# Altium schematic sheet 1_interface.schdoc: OBDH Interface
size A3; Engineer: Eng_2_ALT; SheetNumber: 1; SheetTotal: 6; Designed by: André M. P. Mattos; Version: v0.5
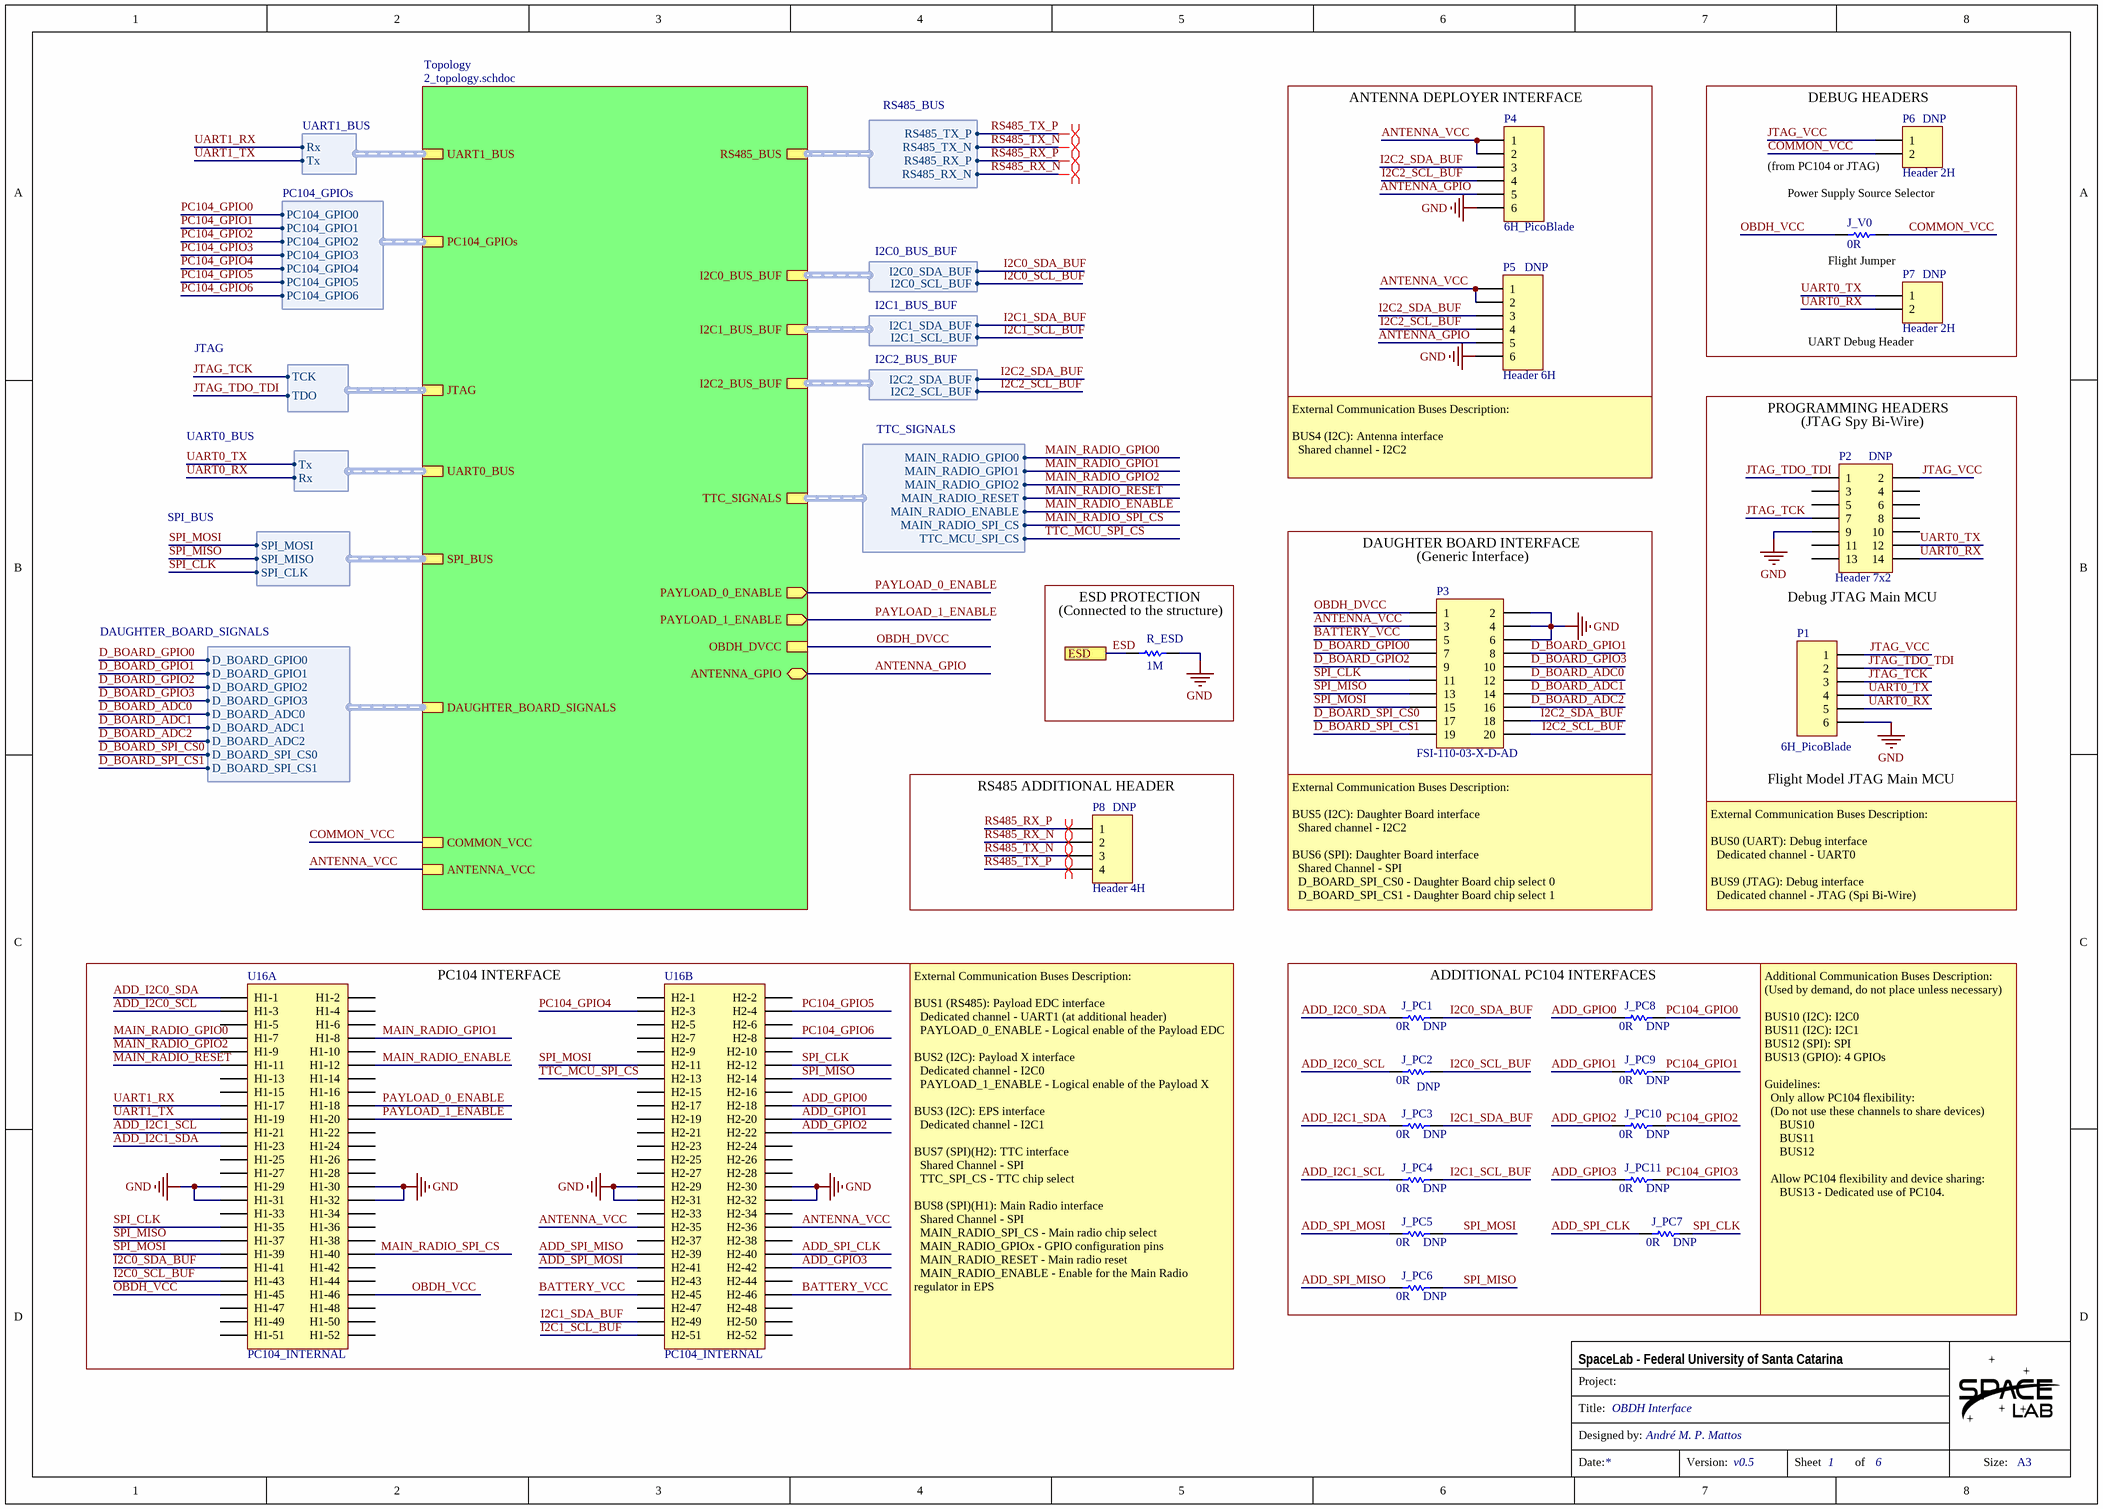
[diagram p0: 1_interface.schdoc]

## Parts
J_PC1  0R  [0805]
J_PC2  0R  [0805]
J_PC3  0R  [0805]
J_PC4  0R  [0805]
J_PC5  0R  [0805]
J_PC6  0R  [0805]
J_PC7  0R  [0805]
J_PC8  0R  [0805]
J_PC9  0R  [0805]
J_PC10  0R  [0805]
J_PC11  0R  [0805]
J_V0  0R  [0805]
P1  6H_PicoBlade  [HDR6 PicoBlade]
P2  Header 7x2  [HDR2X7]
P3  FSI-110-03-X-D-AD  [FSI-110-03-X-D-AD]
P4  6H_PicoBlade  [HDR6 PicoBlade]
P5  Header 6H  [HDR1X6H]
P6  Header 2H  [HDR 1X2]
P7  Header 2H  [HDR 1X2]
P8  Header 4H  [HDR1X4]
R_ESD  1M  [0805]
U16  PC104_INTERNAL  [PC104]  (parts A,B of 2)

## Blocks framed on the sheet
ANTENNA DEPLOYER INTERFACE: P4 P5
DEBUG HEADERS: J_V0 P6 P7
RS485 ADDITIONAL HEADER: P8
PC104 INTERFACE: U16
ADDITIONAL PC104 INTERFACES: J_PC1-J_PC11

## Sub-sheets
Topology = 2_topology.schdoc: PAYLOAD_0_ENABLE (out), PAYLOAD_1_ENABLE (out), ANTENNA_GPIO (bidir), UART0_BUS (harness UART0_BUS), JTAG (harness JTAG), RS485_BUS (harness RS485_BUS), I2C2_BUS_BUF (harness I2C2_BUS_BUF), I2C1_BUS_BUF (harness I2C1_BUS_BUF), I2C0_BUS_BUF (harness I2C0_BUS_BUF), SPI_BUS (harness SPI_BUS), TTC_SIGNALS (harness TTC_SIGNALS), ANTENNA_VCC, COMMON_VCC, DAUGHTER_BOARD_SIGNALS (harness DAUGHTER_BOARD_SIGNALS), OBDH_DVCC, PC104_GPIOs (harness PC104_GPIOs), UART1_BUS (harness UART1_BUS)

## Ports
ESD

## Harnesses
JTAG: TDO, TCK
UART0_BUS: Rx, Tx
I2C0_BUS_BUF: I2C0_SDA_BUF, I2C0_SCL_BUF
I2C2_BUS_BUF: I2C2_SDA_BUF, I2C2_SCL_BUF
I2C1_BUS_BUF: I2C1_SDA_BUF, I2C1_SCL_BUF
RS485_BUS: RS485_TX_P, RS485_TX_N, RS485_RX_P, RS485_RX_N
SPI_BUS: SPI_CLK, SPI_MISO, SPI_MOSI
TTC_SIGNALS: MAIN_RADIO_GPIO0, MAIN_RADIO_GPIO1, MAIN_RADIO_GPIO2, MAIN_RADIO_RESET, MAIN_RADIO_ENABLE, MAIN_RADIO_SPI_CS, TTC_MCU_SPI_CS
DAUGHTER_BOARD_SIGNALS: D_BOARD_GPIO3, D_BOARD_GPIO2, D_BOARD_ADC0, D_BOARD_ADC1, D_BOARD_GPIO1, D_BOARD_GPIO0, D_BOARD_ADC2, D_BOARD_SPI_CS0, D_BOARD_SPI_CS1
UART1_BUS: Rx, Tx
PC104_GPIOs: PC104_GPIO0, PC104_GPIO1, PC104_GPIO2, PC104_GPIO3, PC104_GPIO4, PC104_GPIO5, PC104_GPIO6

## Nets
GND: P1.6 P2.9 P3.2 P3.4 P3.6 P4.6 P5.6 R_ESD.1 U16.H1-29 U16.H1-30 U16.H1-31 U16.H1-32 U16.H2-29 U16.H2-30 U16.H2-31 U16.H2-32
ADD_GPIO0: J_PC8.1 U16.H2-18
ADD_GPIO1: J_PC9.1 U16.H2-20
ADD_GPIO2: J_PC10.1 U16.H2-22
ADD_GPIO3: J_PC11.1 U16.H2-42
ADD_I2C0_SCL: J_PC2.1 U16.H1-3
ADD_I2C0_SDA: J_PC1.1 U16.H1-1
ADD_I2C1_SCL: J_PC4.1 U16.H1-21
ADD_I2C1_SDA: J_PC3.1 U16.H1-23
ADD_SPI_CLK: J_PC7.1 U16.H2-40
ADD_SPI_MISO: J_PC6.1 U16.H2-39
ADD_SPI_MOSI: J_PC5.1 U16.H2-41
ANTENNA_GPIO: P4.5 P5.5 ; sheet Topology/ANTENNA_GPIO
ANTENNA_VCC: P3.3 P4.1 P4.2 P5.1 P5.2 U16.H2-35 U16.H2-36 ; sheet Topology/ANTENNA_VCC
BATTERY_VCC: P3.5 U16.H2-45 U16.H2-46
COMMON_VCC: J_V0.2 P6.2 ; sheet Topology/COMMON_VCC
D_BOARD_ADC0: P3.12 ; sheet Topology/DAUGHTER_BOARD_SIGNALS.D_BOARD_ADC0
D_BOARD_ADC1: P3.14 ; sheet Topology/DAUGHTER_BOARD_SIGNALS.D_BOARD_ADC1
D_BOARD_ADC2: P3.16 ; sheet Topology/DAUGHTER_BOARD_SIGNALS.D_BOARD_ADC2
D_BOARD_GPIO0: P3.7 ; sheet Topology/DAUGHTER_BOARD_SIGNALS.D_BOARD_GPIO0
D_BOARD_GPIO1: P3.8 ; sheet Topology/DAUGHTER_BOARD_SIGNALS.D_BOARD_GPIO1
D_BOARD_GPIO2: P3.9 ; sheet Topology/DAUGHTER_BOARD_SIGNALS.D_BOARD_GPIO2
D_BOARD_GPIO3: P3.10 ; sheet Topology/DAUGHTER_BOARD_SIGNALS.D_BOARD_GPIO3
D_BOARD_SPI_CS0: P3.17 ; sheet Topology/DAUGHTER_BOARD_SIGNALS.D_BOARD_SPI_CS0
D_BOARD_SPI_CS1: P3.19 ; sheet Topology/DAUGHTER_BOARD_SIGNALS.D_BOARD_SPI_CS1
ESD: R_ESD.2 ; port ESD
I2C0_SCL_BUF: J_PC2.2 U16.H1-43 ; sheet Topology/I2C0_BUS_BUF.I2C0_SCL_BUF
I2C0_SDA_BUF: J_PC1.2 U16.H1-41 ; sheet Topology/I2C0_BUS_BUF.I2C0_SDA_BUF
I2C1_SCL_BUF: J_PC4.2 U16.H2-51 ; sheet Topology/I2C1_BUS_BUF.I2C1_SCL_BUF
I2C1_SDA_BUF: J_PC3.2 U16.H2-49 ; sheet Topology/I2C1_BUS_BUF.I2C1_SDA_BUF
I2C2_SCL_BUF: P3.20 P4.4 P5.4 ; sheet Topology/I2C2_BUS_BUF.I2C2_SCL_BUF
I2C2_SDA_BUF: P3.18 P4.3 P5.3 ; sheet Topology/I2C2_BUS_BUF.I2C2_SDA_BUF
JTAG_TCK: P1.3 P2.7 ; sheet Topology/JTAG.TCK
JTAG_TDO_TDI: P1.2 P2.1 ; sheet Topology/JTAG.TDO
JTAG_VCC: P1.1 P2.2 P6.1
MAIN_RADIO_ENABLE: U16.H1-12 ; sheet Topology/TTC_SIGNALS.MAIN_RADIO_ENABLE
MAIN_RADIO_GPIO0: U16.H1-7 ; sheet Topology/TTC_SIGNALS.MAIN_RADIO_GPIO0
MAIN_RADIO_GPIO1: U16.H1-8 ; sheet Topology/TTC_SIGNALS.MAIN_RADIO_GPIO1
MAIN_RADIO_GPIO2: U16.H1-9 ; sheet Topology/TTC_SIGNALS.MAIN_RADIO_GPIO2
MAIN_RADIO_RESET: U16.H1-11 ; sheet Topology/TTC_SIGNALS.MAIN_RADIO_RESET
MAIN_RADIO_SPI_CS: U16.H1-40 ; sheet Topology/TTC_SIGNALS.MAIN_RADIO_SPI_CS
OBDH_DVCC: P3.1 ; sheet Topology/OBDH_DVCC
OBDH_VCC: J_V0.1 U16.H1-45 U16.H1-46
PAYLOAD_0_ENABLE: U16.H1-18 ; sheet Topology/PAYLOAD_0_ENABLE
PAYLOAD_1_ENABLE: U16.H1-20 ; sheet Topology/PAYLOAD_1_ENABLE
PC104_GPIO0: J_PC8.2 ; sheet Topology/PC104_GPIOs.PC104_GPIO0
PC104_GPIO1: J_PC9.2 ; sheet Topology/PC104_GPIOs.PC104_GPIO1
PC104_GPIO2: J_PC10.2 ; sheet Topology/PC104_GPIOs.PC104_GPIO2
PC104_GPIO3: J_PC11.2 ; sheet Topology/PC104_GPIOs.PC104_GPIO3
PC104_GPIO4: U16.H2-3 ; sheet Topology/PC104_GPIOs.PC104_GPIO4
PC104_GPIO5: U16.H2-4 ; sheet Topology/PC104_GPIOs.PC104_GPIO5
PC104_GPIO6: U16.H2-8 ; sheet Topology/PC104_GPIOs.PC104_GPIO6
RS485_RX_N: P8.2 ; sheet Topology/RS485_BUS.RS485_RX_N
RS485_RX_P: P8.1 ; sheet Topology/RS485_BUS.RS485_RX_P
RS485_TX_N: P8.3 ; sheet Topology/RS485_BUS.RS485_TX_N
RS485_TX_P: P8.4 ; sheet Topology/RS485_BUS.RS485_TX_P
SPI_CLK: J_PC7.2 P3.11 U16.H1-35 U16.H2-12 ; sheet Topology/SPI_BUS.SPI_CLK
SPI_MISO: J_PC6.2 P3.13 U16.H1-37 U16.H2-14 ; sheet Topology/SPI_BUS.SPI_MISO
SPI_MOSI: J_PC5.2 P3.15 U16.H1-39 U16.H2-11 ; sheet Topology/SPI_BUS.SPI_MOSI
TTC_MCU_SPI_CS: U16.H2-13 ; sheet Topology/TTC_SIGNALS.TTC_MCU_SPI_CS
UART0_RX: P1.5 P2.14 P7.2 ; sheet Topology/UART0_BUS.Rx
UART0_TX: P1.4 P2.12 P7.1 ; sheet Topology/UART0_BUS.Tx
UART1_RX: U16.H1-17 ; sheet Topology/UART1_BUS.Rx
UART1_TX: U16.H1-19 ; sheet Topology/UART1_BUS.Tx

Not connected (* = marked no-connect by the designer): P2 3 4 5 6 8 10 11 13; U16 H1-2 H1-4 H1-5 H1-6 H1-10 H1-13 H1-14 H1-15 H1-16 H1-22 H1-24 H1-25 H1-26 H1-27 H1-28 H1-33 H1-34 H1-36 H1-38 H1-42 H1-44 H1-47 H1-48 H1-49 H1-50 H1-51 H1-52 H2-1 H2-2 H2-5 H2-6 H2-7 H2-9 H2-10 H2-15 H2-16 H2-17 H2-19 H2-21 H2-23 H2-24 H2-25 H2-26 H2-27 H2-28 H2-33 H2-34 H2-37 H2-38 H2-43 H2-44 H2-47 H2-48 H2-50 H2-52

## Layout directives
differential pair: RS485_RX_N, RS485_RX_P, RS485_TX_N, RS485_TX_P

## Notes on the sheet
- (near P6) (from PC104 or JTAG)
- (near P6) DNP
- Power Supply Source Selector
- (near P5) DNP
- Flight Jumper
- (near P7) DNP
- (near P7) UART Debug Header
- PROGRAMMING HEADERS
- (near P2) (JTAG Spy Bi-Wire)
- (near P5) External Communication Buses Description:
  BUS4 (I2C): Antenna interface
  Shared channel - I2C2
- (near P2) DNP
- DAUGHTER BOARD INTERFACE
- (near P3) (Generic Interface)
- (near R_ESD) (Connected to the structure)
- (near R_ESD) ESD PROTECTION
- Debug JTAG Main MCU
- (near P1) Flight Model JTAG Main MCU
- (near P8) DNP
- (near P3) External Communication Buses Description:
  BUS5 (I2C): Daughter Board interface
  Shared channel - I2C2
  BUS6 (SPI): Daughter Board interface
  Shared Channel - SPI
  D_BOARD_SPI_CS0 - Daughter Board chip select 0
  D_BOARD_SPI_CS1 - Daughter Board chip select 1
- External Communication Buses Description:
  BUS0 (UART): Debug interface
  Dedicated channel - UART0
  BUS9 (JTAG): Debug interface
  Dedicated channel - JTAG (Spi Bi-Wire)
- (near J_PC1) DNP
- (near J_PC8) DNP
- (near J_PC2) DNP
- (near J_PC9) DNP
- (near J_PC3) DNP
- (near J_PC4) DNP
- (near J_PC10) DNP
- (near J_PC11) DNP
- (near J_PC5) DNP
- (near J_PC7) DNP
- (near J_PC6) DNP
- Additional Communication Buses Description:
  (Used by demand, do not place unless necessary)
  BUS10 (I2C): I2C0
  BUS11 (I2C): I2C1
  BUS12 (SPI): SPI
  BUS13 (GPIO): 4 GPIOs
  Guidelines:
  Only allow PC104 flexibility:
  (Do not use these channels to share devices)
  BUS10
  BUS11
  BUS12
  Allow PC104 flexibility and device sharing:
  BUS13 - Dedicated use of PC104.
- External Communication Buses Description:
  BUS1 (RS485): Payload EDC interface
  Dedicated channel - UART1 (at additional header)
  PAYLOAD_0_ENABLE - Logical enable of the Payload EDC
  BUS2 (I2C): Payload X interface
  Dedicated channel - I2C0
  PAYLOAD_1_ENABLE - Logical enable of the Payload X
  BUS3 (I2C): EPS interface
  Dedicated channel - I2C1
  BUS7 (SPI)(H2): TTC interface
  Shared Channel - SPI
  TTC_SPI_CS - TTC chip select
  BUS8 (SPI)(H1): Main Radio interface
  Shared Channel - SPI
  MAIN_RADIO_SPI_CS - Main radio chip select
  MAIN_RADIO_GPIOx - GPIO configuration pins
  MAIN_RADIO_RESET - Main radio reset
  MAIN_RADIO_ENABLE - Enable for the Main Radio regulator in EPS
- Project:
- SpaceLab - Federal University of Santa Catarina
- Title:
- Designed by:
- Date:
- Version:
- Sheet
- of
- Size:
- A3

## Library data of the parts
J_PC1-J_PC11 J_V0 = R0R_JUMPER_1/16W_0805: RES 0R OHM 1/16W JUMPER 0805; Partnumber: CRCW08050000Z0EA; NCM: 8533.21.20
P1 P4 = Header 6H_PicoBlade: Header, 6-Pin, Right Angle; Partnumber: 53398-0671; LatestRevisionDate: 17-Jul-2002; LatestRevisionNote: Re-released for DXP Platform.; Publisher: Altium Limited
P2 = Header 7X2: Header, 7-Pin, Dual row; LatestRevisionDate: 17-Jul-2002; LatestRevisionNote: Re-released for DXP Platform.; Publisher: Altium Limited
P3 = FSI-110-03-X-D-AD: Contact Connector; Partnumber: FSI-110-03-G-D-AD; Value: *
P5 = Header 6H: Header, 6-Pin, Right Angle; LatestRevisionDate: 17-Jul-2002; LatestRevisionNote: Re-released for DXP Platform.; Publisher: Altium Limited
P6 P7 = Header 2: Header, 2-Pin; PartNumber: 826646-2; LatestRevisionDate: 17-Jul-2002; LatestRevisionNote: Re-released for DXP Platform.; Publisher: Altium Limited
P8 = Header 4H: Header, 4-Pin; LatestRevisionDate: 17-Jul-2002; LatestRevisionNote: Re-released for DXP Platform.; Publisher: Altium Limited
R_ESD = R1000k_1%_1/8W_0805: RES 1000K OHM 1/8W 1% 0805; Partnumber: AC0805FR-13100KL; NCM: 8533.21.20
U16 = PC104: Partnumber: SSW-126-04-G-D